# Altium project staircase controller.PrjPcb
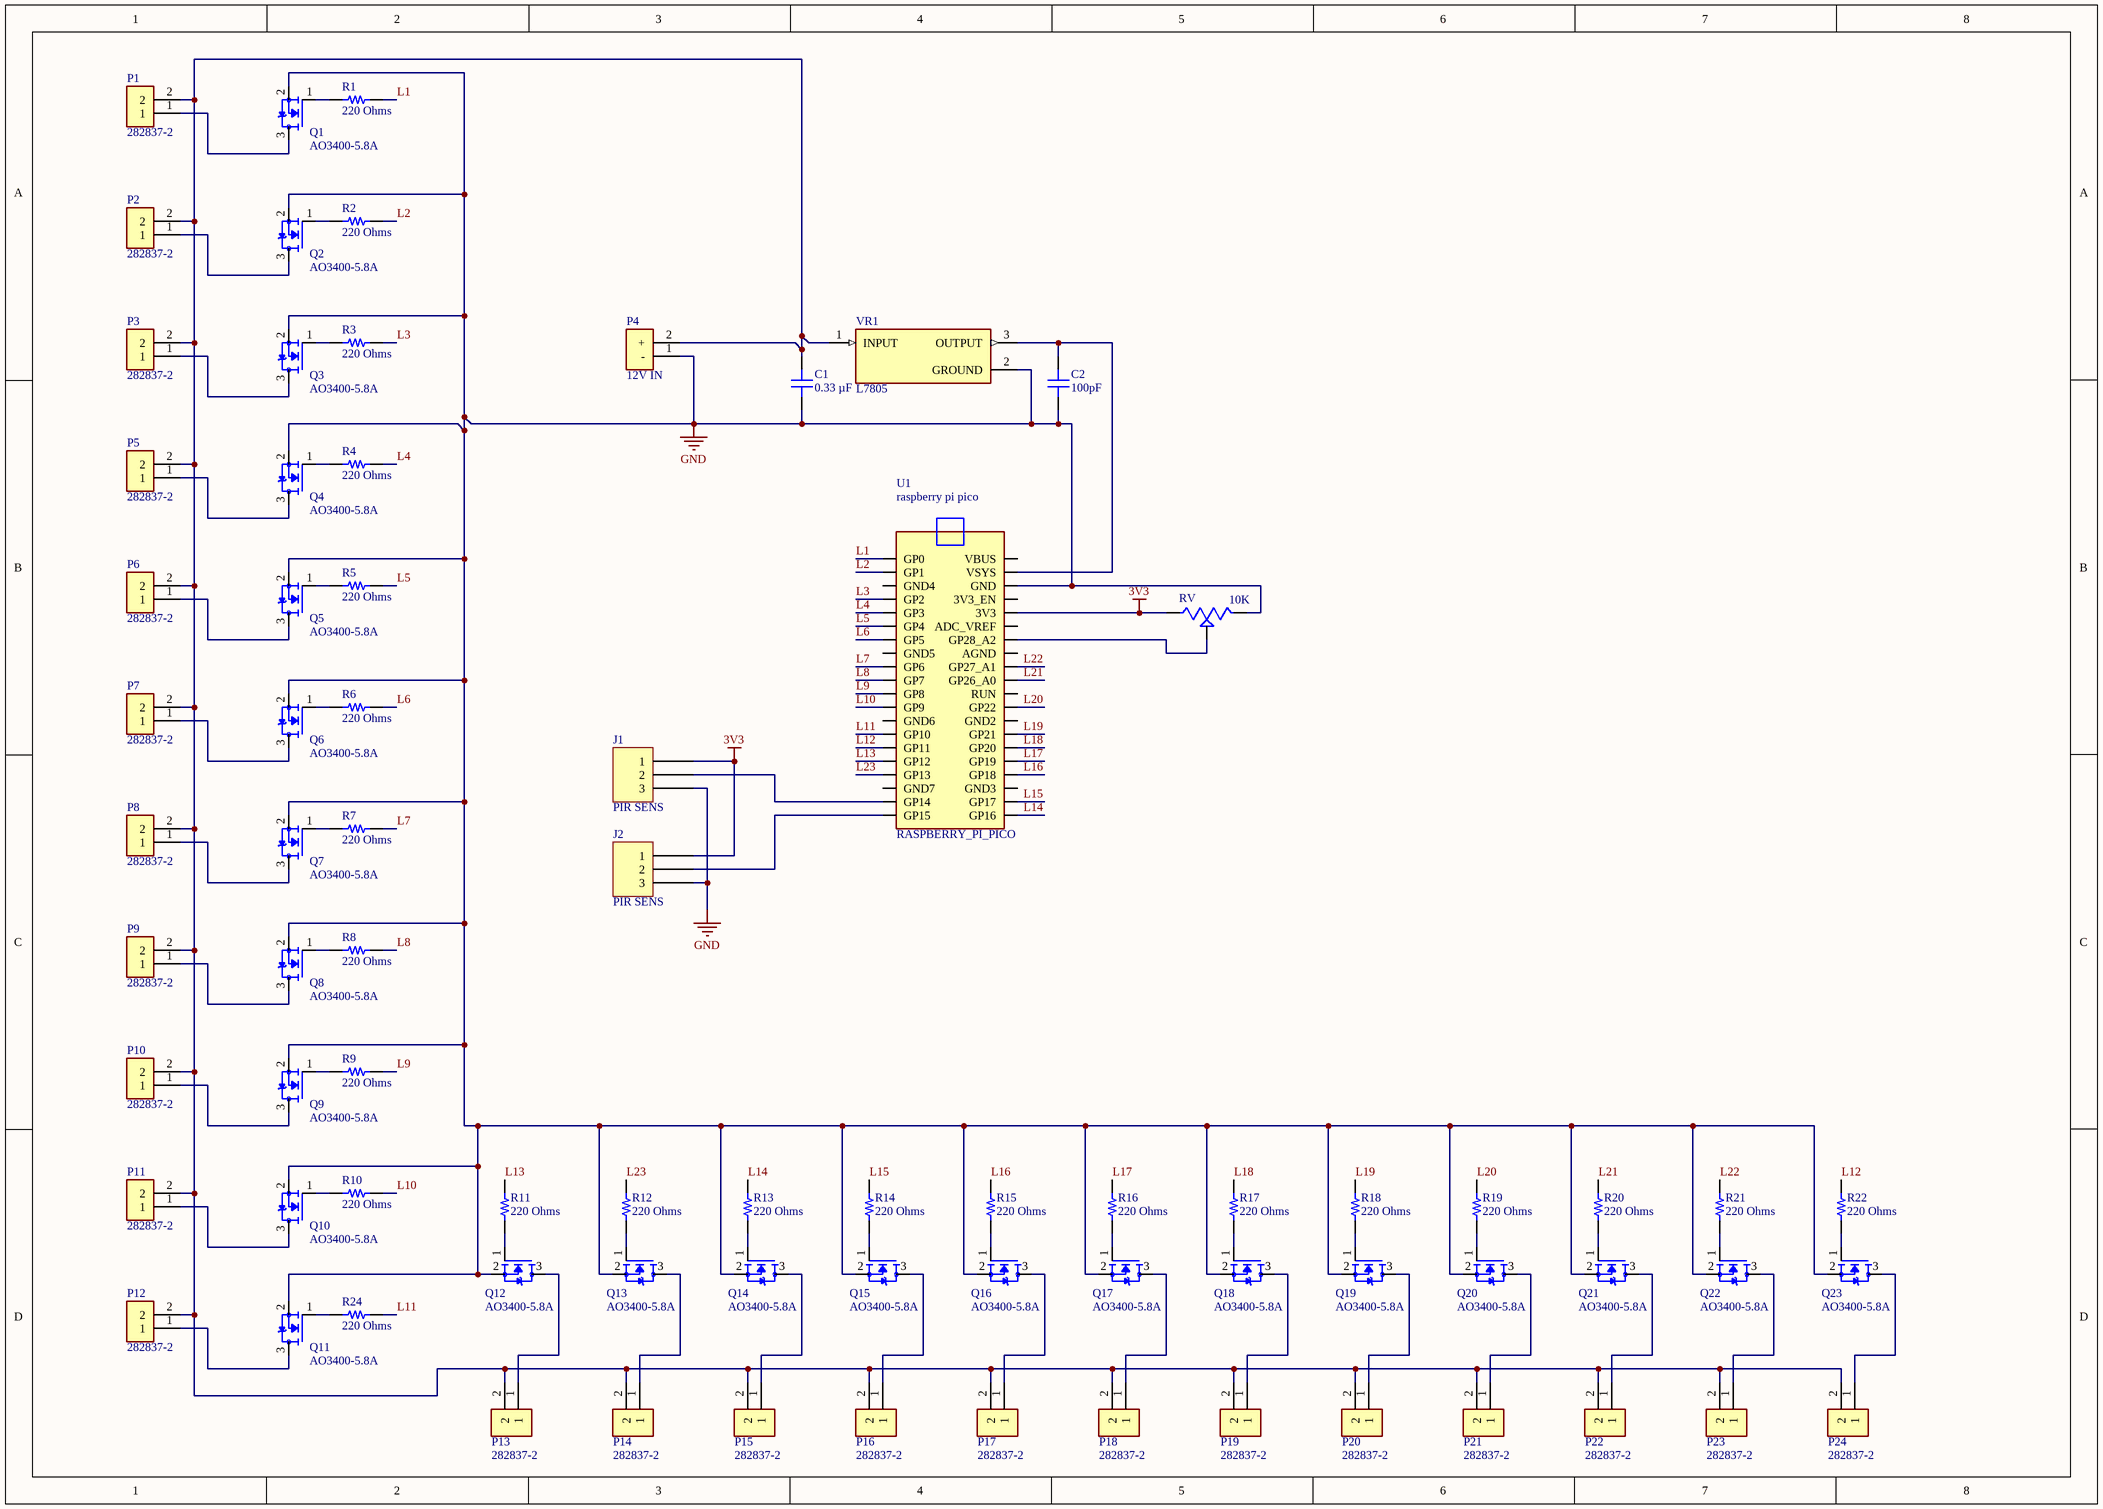
[diagram p0: RP Pico.SchDoc]
1 sheet, 77 parts. Net scope: global (net labels, ports and power ports of the same name join across sheets).
Board file: staircase PCB1.PcbDoc

## Sheet RP Pico.SchDoc
size A3; SheetNumber: 1; SheetTotal: 1

### Parts
C1  0.33 µF  [CAP 1206_3216 - 0.8MM]
C2  100pF  [CAP 1206_3216 - 0.8MM]
J1  PIR SENS  [HARWIN M20-7820345]
J2  PIR SENS  [HARWIN M20-7820345]
P1  282837-2  [TE_282837-2]
P2  282837-2  [TE_282837-2]
P3  282837-2  [TE_282837-2]
P4  12V IN  [TE_282837-2]
P5  282837-2  [TE_282837-2]
P6  282837-2  [TE_282837-2]
P7  282837-2  [TE_282837-2]
P8  282837-2  [TE_282837-2]
P9  282837-2  [TE_282837-2]
P10  282837-2  [TE_282837-2]
P11  282837-2  [TE_282837-2]
P12  282837-2  [TE_282837-2]
P13  282837-2  [TE_282837-2]
P14  282837-2  [TE_282837-2]
P15  282837-2  [TE_282837-2]
P16  282837-2  [TE_282837-2]
P17  282837-2  [TE_282837-2]
P18  282837-2  [TE_282837-2]
P19  282837-2  [TE_282837-2]
P20  282837-2  [TE_282837-2]
P21  282837-2  [TE_282837-2]
P22  282837-2  [TE_282837-2]
P23  282837-2  [TE_282837-2]
P24  282837-2  [TE_282837-2]
Q1  AO3400-5.8A  [SOT95P260X140-3N]
Q2  AO3400-5.8A  [SOT95P260X140-3N]
Q3  AO3400-5.8A  [SOT95P260X140-3N]
Q4  AO3400-5.8A  [SOT95P260X140-3N]
Q5  AO3400-5.8A  [SOT95P260X140-3N]
Q6  AO3400-5.8A  [SOT95P260X140-3N]
Q7  AO3400-5.8A  [SOT95P260X140-3N]
Q8  AO3400-5.8A  [SOT95P260X140-3N]
Q9  AO3400-5.8A  [SOT95P260X140-3N]
Q10  AO3400-5.8A  [SOT95P260X140-3N]
Q11  AO3400-5.8A  [SOT95P260X140-3N]
Q12  AO3400-5.8A  [SOT95P260X140-3N]
Q13  AO3400-5.8A  [SOT95P260X140-3N]
Q14  AO3400-5.8A  [SOT95P260X140-3N]
Q15  AO3400-5.8A  [SOT95P260X140-3N]
Q16  AO3400-5.8A  [SOT95P260X140-3N]
Q17  AO3400-5.8A  [SOT95P260X140-3N]
Q18  AO3400-5.8A  [SOT95P260X140-3N]
Q19  AO3400-5.8A  [SOT95P260X140-3N]
Q20  AO3400-5.8A  [SOT95P260X140-3N]
Q21  AO3400-5.8A  [SOT95P260X140-3N]
Q22  AO3400-5.8A  [SOT95P260X140-3N]
Q23  AO3400-5.8A  [SOT95P260X140-3N]
R1  220 Ohms  [YAGEO RES 1206_3216]
R2  220 Ohms  [YAGEO RES 1206_3216]
R3  220 Ohms  [YAGEO RES 1206_3216]
R4  220 Ohms  [YAGEO RES 1206_3216]
R5  220 Ohms  [YAGEO RES 1206_3216]
R6  220 Ohms  [YAGEO RES 1206_3216]
R7  220 Ohms  [YAGEO RES 1206_3216]
R8  220 Ohms  [YAGEO RES 1206_3216]
R9  220 Ohms  [YAGEO RES 1206_3216]
R10  220 Ohms  [YAGEO RES 1206_3216]
R11  220 Ohms  [YAGEO RES 1206_3216]
R12  220 Ohms  [YAGEO RES 1206_3216]
R13  220 Ohms  [YAGEO RES 1206_3216]
R14  220 Ohms  [YAGEO RES 1206_3216]
R15  220 Ohms  [YAGEO RES 1206_3216]
R16  220 Ohms  [YAGEO RES 1206_3216]
R17  220 Ohms  [YAGEO RES 1206_3216]
R18  220 Ohms  [YAGEO RES 1206_3216]
R19  220 Ohms  [YAGEO RES 1206_3216]
R20  220 Ohms  [YAGEO RES 1206_3216]
R21  220 Ohms  [YAGEO RES 1206_3216]
R22  220 Ohms  [YAGEO RES 1206_3216]
R24  220 Ohms  [YAGEO RES 1206_3216]
RV  10K  [TRIM_PTN06-D02CB20]
U1  RASPBERRY_PI_PICO  [RASPBERRY_PI_PICO]
VR1  L7805  [TO255P1020X450X2000-3]

### Nets
3V3: J1.1 J2.1 RV.1(INITIAL) U1.3V3
GND: C1.1 C2.2 J1.3 J2.3 P4.1(-) Q1.2(S) Q2.2(S) Q3.2(S) Q4.2(S) Q5.2(S) Q6.2(S) Q7.2(S) Q8.2(S) Q9.2(S) Q10.2(S) Q11.2(S) Q12.2(S) Q13.2(S) Q14.2(S) Q15.2(S) Q16.2(S) Q17.2(S) Q18.2(S) Q19.2(S) Q20.2(S) Q21.2(S) Q22.2(S) Q23.2(S) RV.3(FINAL) U1.GND VR1.2(GROUND)
L1: R1.2 U1.GP0
L2: R2.2 U1.GP1
L3: R3.2 U1.GP2
L4: R4.2 U1.GP3
L5: R5.2 U1.GP4
L6: R6.2 U1.GP5
L7: R7.2 U1.GP6
L8: R8.2 U1.GP7
L9: R9.2 U1.GP8
L10: R10.2 U1.GP9
L11: R24.2 U1.GP10
L12: R22.2 U1.GP11
L13: R11.2 U1.GP12
L14: R13.2 U1.GP16
L15: R14.2 U1.GP17
L16: R15.2 U1.GP18
L17: R16.2 U1.GP19
L18: R17.2 U1.GP20
L19: R18.2 U1.GP21
L20: R19.2 U1.GP22
L21: R20.2 U1.GP26_A0
L22: R21.2 U1.GP27_A1
L23: R12.2 U1.GP13
NetC1_2: C1.2 P1.2 P2.2 P3.2 P4.2(+) P5.2 P6.2 P7.2 P8.2 P9.2 P10.2 P11.2 P12.2 P13.2 P14.2 P15.2 P16.2 P17.2 P18.2 P19.2 P20.2 P21.2 P22.2 P23.2 P24.2 VR1.1(INPUT)
NetC2_1: C2.1 U1.VSYS VR1.3(OUTPUT)
NetJ1_2: J1.2 U1.GP14
NetJ2_2: J2.2 U1.GP15
NetP1_1: P1.1 Q1.3(D)
NetP2_1: P2.1 Q2.3(D)
NetP3_1: P3.1 Q3.3(D)
NetP5_1: P5.1 Q4.3(D)
NetP6_1: P6.1 Q5.3(D)
NetP7_1: P7.1 Q6.3(D)
NetP8_1: P8.1 Q7.3(D)
NetP9_1: P9.1 Q8.3(D)
NetP10_1: P10.1 Q9.3(D)
NetP11_1: P11.1 Q10.3(D)
NetP12_1: P12.1 Q11.3(D)
NetP13_1: P13.1 Q12.3(D)
NetP14_1: P14.1 Q13.3(D)
NetP15_1: P15.1 Q14.3(D)
NetP16_1: P16.1 Q15.3(D)
NetP17_1: P17.1 Q16.3(D)
NetP18_1: P18.1 Q17.3(D)
NetP19_1: P19.1 Q18.3(D)
NetP20_1: P20.1 Q19.3(D)
NetP21_1: P21.1 Q20.3(D)
NetP22_1: P22.1 Q21.3(D)
NetP23_1: P23.1 Q22.3(D)
NetP24_1: P24.1 Q23.3(D)
NetQ1_1: Q1.1(G) R1.1
NetQ2_1: Q2.1(G) R2.1
NetQ3_1: Q3.1(G) R3.1
NetQ4_1: Q4.1(G) R4.1
NetQ5_1: Q5.1(G) R5.1
NetQ6_1: Q6.1(G) R6.1
NetQ7_1: Q7.1(G) R7.1
NetQ8_1: Q8.1(G) R8.1
NetQ9_1: Q9.1(G) R9.1
NetQ10_1: Q10.1(G) R10.1
NetQ11_1: Q11.1(G) R24.1
NetQ12_1: Q12.1(G) R11.1
NetQ13_1: Q13.1(G) R12.1
NetQ14_1: Q14.1(G) R13.1
NetQ15_1: Q15.1(G) R14.1
NetQ16_1: Q16.1(G) R15.1
NetQ17_1: Q17.1(G) R16.1
NetQ18_1: Q18.1(G) R17.1
NetQ19_1: Q19.1(G) R18.1
NetQ20_1: Q20.1(G) R19.1
NetQ21_1: Q21.1(G) R20.1
NetQ22_1: Q22.1(G) R21.1
NetQ23_1: Q23.1(G) R22.1
NetRV_2: RV.2(WIPER) U1.GP28_A2

Not connected (* = marked no-connect by the designer): U1 3V3_EN ADC_VREF AGND GND2 GND3 GND4 GND5 GND6 GND7 RUN VBUS

### Notes on the sheet
- (in symbol RASPBERRY_PI_PICO) raspberry pi pico

### Library data of the parts
C1 = CC1206JKX7R8BB334: CAP CER 0.33UF 25V X7R 1206; manufacturer: Yageo; Tolerance: ±5%; Part Number: CC1206JKX7R8BB334; Capacitance: 0.33 µF; Applications: General Purpose; componentlink1description: Datasheet; componentlink1url: https://www.yageo.com/upload/media/product/app/datasheet/mlcc/upy-gphc_x7r_6_3v-to-250v.pdf; componentlink2description: DigiKey Link; componentlink2url: https://www.digikey.com/en/products/detail/yageo/CC1206JKX7R8BB334/5884429; Device Package: 1206 (3216 Metric); Features: High Voltage; lastupdated: 04-06-2024 19:09:58; Lifecycle Status: Active; Minimum Order: 1; Mounting Type: Surface Mount, MLCC; Operating Temperature: -55°C ~ 125°C; Package / Case: 1206 (3216 Metric); packaging: TapeAndReel; partid: 59979; price: 0.05; series: CC; Size / Dimension: 0.126" L x 0.063" W (3.20mm x 1.60mm); Supplier 1: DigiKey; Supplier Part Number 1: 13-CC1206JKX7R8BB334CT-ND; Temperature Coefficient: X7R; Thickness (Max): 0.037" (0.95mm); value: 0.33 µF; Voltage - Rated: 25V
C2 = MM061A101JCT2A: CAP CER 100PF 100V C0G/NP0 1206; manufacturer: AVX Corporation; Temperature Coefficient: C0G, NP0; Tolerance: ±5%; Part Number: MM061A101JCT2A; Capacitance: 100pF; Applications: Medical, Non-Critical; componentlink1description: Datasheet; componentlink1url: http://datasheets.avx.com/AVX-MM.pdf; componentlink2description: DigiKey Link; componentlink2url: http://digikey.com/product-detail/en/avx-corporation/MM061A101JCT2A/478-10622-1-ND/7344883; Device Package: 1206 (3216 Metric); lastupdated: 02-09-2020 01:04:46; Lifecycle Status: Active; Minimum Order: 1; Mounting Type: Surface Mount, MLCC; Operating Temperature: -55°C ~ 125°C; Package / Case: 1206 (3216 Metric); packaging: TapeAndReel; partid: 18685; Part Status: Active; price: 0.52; series: MM; Size / Dimension: 0.126" L x 0.063" W (3.20mm x 1.60mm); Supplier 1: DigiKey; Supplier Part Number 1: 478-10622-1-ND; Thickness (Max): 0.029" (0.74mm); value: 100pF; Voltage - Rated: 100V
J1 J2 = M20-7820342: CONN RCPT 3POS 0.1 GOLD PCB; Manufacturer: Harwin Inc.; Connector Type: Receptacle; Contact Length - Post: 0.118" (3.00mm); Current Rating (Amps): 3A; Mated Stacking Heights: 11.04mm, 12.63mm; Material Flammability Rating: UL94 V-0; Number of Positions: 3; Number of Positions Loaded: All; Pitch - Mating: 0.100" (2.54mm); Style: Board to Board or Cable; Part Number: M20-7820342; ComponentLink1Description: Datasheet; ComponentLink1URL: https://cdn.harwin.com/pdfs/Harwin_PC_Connectors_M20.pdf; ComponentLink2Description: DigiKey Link; ComponentLink2URL: https://www.digikey.com/en/products/detail/harwin-inc/M20-7820342/3727752; Contact Finish - Mating: Gold; Contact Finish - Post: Tin; Contact Finish Thickness - Mating: Flash; Contact Type: Female Socket; Fastening Type: Push-Pull; Insulation Color: Black; Insulation Height: 0.335" (8.51mm); LastUpdated: 21-09-2022 18:55:13; Lifecycle Status: Active; Minimum Order: 1; Mounting Type: Through Hole; Number of Rows: 1; Operating Temperature: -40°C ~ 105°C; Packaging: Tube; Part Status: Active; Price: 0.42; Series: M20; Supplier 1: DigiKey; Supplier Part Number 1: 952-1783-ND; Termination: Solder
P1-P24 = 282837-2: Ð Ð°Ð·ÑŠÐµÐ¼Ð½Ñ‹Ðµ ÐºÐ»ÐµÐ¼Ð¼Ð½Ñ‹Ðµ ÐºÐ¾Ð»Ð¾Ð´ÐºÐ¸ Ð Ð¾Ð·ÐµÑ‚ÐºÐ° 2 Ð¿Ð¾Ð»Ð¾Ð¶ÐµÐ½Ð¸Ñ 5,08 Ð¼Ð¼ ÐŸÑ€Ð¸Ð¿Ð¾Ð¹ Ð¿Ñ€ÑÐ¼Ð¾Ð¹ Ñ‡ÐµÑ€ÐµÐ· Ð¾Ñ‚Ð²ÐµÑ€ÑÑ‚Ð¸Ðµ 13,5 Ð / ÐºÐ¾Ð½Ñ‚Ð°ÐºÑ‚; MF: TE Connectivity; SnapEDA_Link: https://www.snapeda.com/parts/282837-2/TE+Connectivity+AMP+Connectors/view-part/?ref=snap; Price: None; Check_prices: https://www.snapeda.com/parts/282837-2/TE+Connectivity+AMP+Connectors/view-part/?ref=eda; Purchase-URL: https://pricing.snapeda.com/search/part/282837-2/?ref=eda; MP: 282837-2; Value: *; Availability: In Stock; Package: None
Q1-Q23 = AO3400-5.8A: N-Channel 30 V 5.8A (Ta) 1.5W (Ta) Surface Mount SOT-23; MF: MDD; Check_prices: https://www.snapeda.com/parts/AO3400-5.8A/MDD/view-part/?ref=eda; Value: *; Availability: In Stock; MP: AO3400-5.8A; Price: None; Package: None; SnapEDA_Link: https://www.snapeda.com/parts/AO3400-5.8A/MDD/view-part/?ref=snap; Purchase-URL: https://pricing.snapeda.com/search/part/AO3400-5.8A/?ref=eda
R1-R22 R24 = AC1206JR-07220RL: RES SMD 220 OHM 5% 1/4W 1206; Manufacturer: Yageo; Power (Watts): 0.25W, 1/4W; Temperature Coefficient: ±100ppm/°C; Part Number: AC1206JR-07220RL; ComponentLink1Description: Datasheet; ComponentLink1URL: https://www.yageo.com/upload/media/product/productsearch/datasheet/rchip/PYu-AC_51_RoHS_L_7.pdf; ComponentLink2Description: DigiKey Link; ComponentLink2URL: https://www.digikey.com/en/products/detail/yageo/AC1206JR-07220RL/5897808; Composition: Thick Film; Device Package: 1206 (3216 Metric); Features: Automotive AEC-Q200, Moisture Resistant; Height - Seated (Max): 0.026" (0.65mm); LastUpdated: 25-07-2024 09:21:37; Lifecycle Status: Active; Minimum Order: 1; Number of Terminations: 2; Operating Temperature: -55°C ~ 155°C; Package / Case: 1206 (3216 Metric); Packaging: TapeAndReel; PartId: 27518; Part Status: Active; Price: 0.01; Ratings: AEC-Q200; Resistance: 220 Ohms; Series: AC; Size / Dimension: 0.122" L x 0.063" W (3.10mm x 1.60mm); Supplier 1: DigiKey; Supplier Part Number 1: YAG3937CT-ND; Supplier Device Package: 1206; Tolerance: ±5%; Value: 220 Ohms
RV = PTN06-D02CB20: Package: None; Price: None; Value: *; MP: PTN06-D02CB20; Availability: Unavailable
U1 = RASPBERRY_PI_PICO: Raspberry Pi Board, Arm Cortex-M0+; Core Architecture:Arm; Core Sub-Architecture:Cortex-M0+; Kit Contents:Raspberry Pi Pico Board; No. Of Bits:32Bit; Silicon Core Number:Rp2040; Silicon Manufacturer:Raspberry Pi |Raspberry-Pi RASPBERRY PI PICO; SnapEDA_Link: https://www.snapeda.com/parts/RASPBERRY%20PI%20PICO/Raspberry+Pi/view-part/?ref=snap; Package: None; Value: *; MF: Raspberry Pi; MP: RASPBERRY PI PICO; Check_prices: https://www.snapeda.com/parts/RASPBERRY%20PI%20PICO/Raspberry+Pi/view-part/?ref=eda
VR1 = L7805: Standard Regulator Pos 5V 1.5A 3-Pin(3+Tab) TO-220FP Tube; MF: STMicroelectronics; MP: L7805; Value: *; SnapEDA_Link: https://www.snapeda.com/parts/L7805/STMicroelectronics/view-part/?ref=snap; Price: None; Package: None; Check_prices: https://www.snapeda.com/parts/L7805/STMicroelectronics/view-part/?ref=eda; Availability: Not in stock